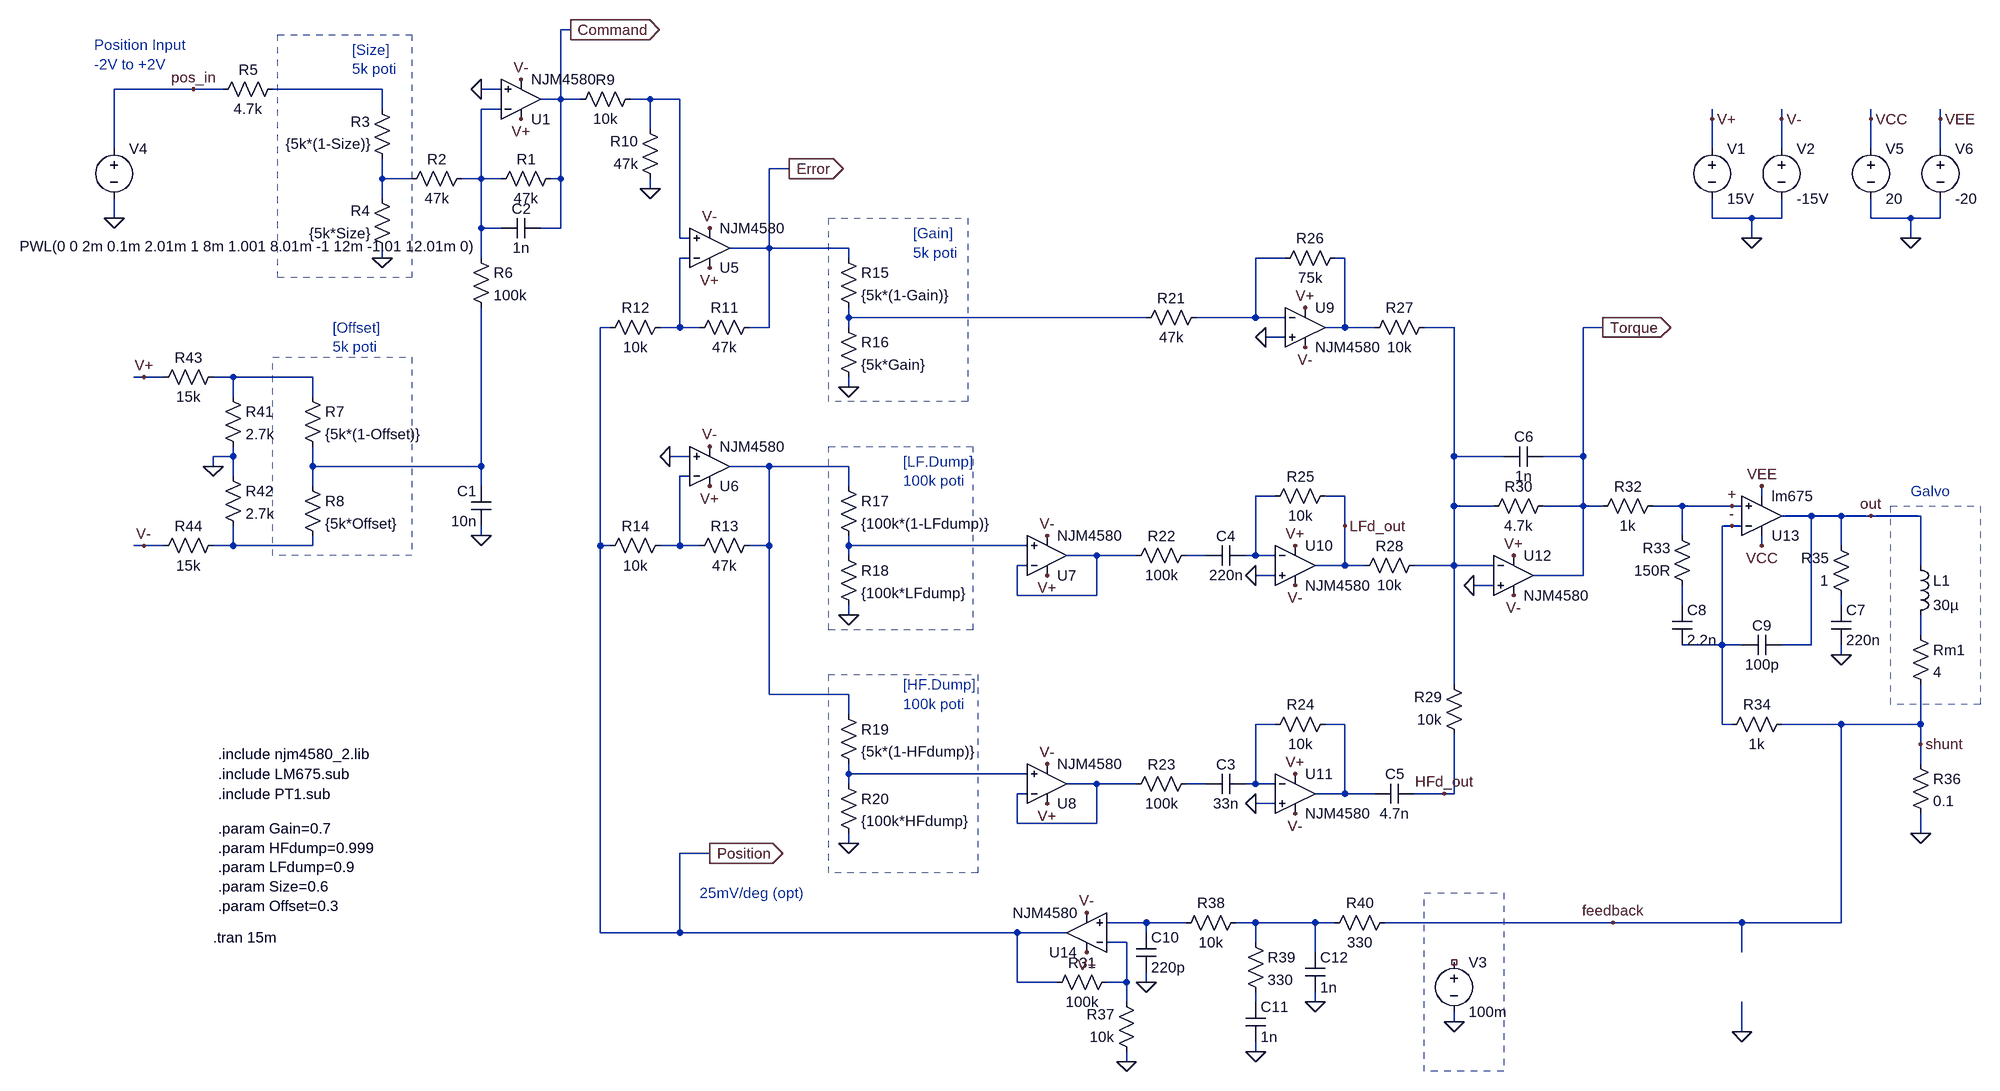
[diagram p0: schematic ctrlcircuit_v2.asc]
ctrlcircuit_v2.asc, the LTspice schematic file:
Version 4
SHEET 1 2372 1848
WIRE -208 144 -224 144
WIRE -816 240 -944 240
WIRE -768 240 -816 240
WIRE -512 240 -688 240
WIRE -320 240 -352 240
WIRE -224 256 -224 144
WIRE -224 256 -256 256
WIRE -192 256 -224 256
WIRE -80 256 -112 256
WIRE -32 256 -80 256
WIRE -512 272 -512 240
WIRE -320 272 -352 272
WIRE 1632 288 1632 272
WIRE 1744 288 1744 272
WIRE 1888 288 1888 272
WIRE 2000 288 2000 272
WIRE -80 304 -80 256
WIRE -944 336 -944 240
WIRE 1632 336 1632 288
WIRE 1744 336 1744 288
WIRE 1888 336 1888 288
WIRE 2000 336 2000 288
WIRE 144 368 112 368
WIRE -512 384 -512 352
WIRE -464 384 -512 384
WIRE -352 384 -352 272
WIRE -352 384 -384 384
WIRE -320 384 -352 384
WIRE -224 384 -224 256
WIRE -224 384 -240 384
WIRE -80 400 -80 384
WIRE -512 416 -512 384
WIRE -944 448 -944 416
WIRE 1632 448 1632 416
WIRE 1696 448 1632 448
WIRE 1744 448 1744 416
WIRE 1744 448 1696 448
WIRE 1888 448 1888 416
WIRE 1952 448 1888 448
WIRE 2000 448 2000 416
WIRE 2000 448 1952 448
WIRE -352 464 -352 384
WIRE -320 464 -352 464
WIRE -224 464 -224 384
WIRE -224 464 -256 464
WIRE -32 480 -32 256
WIRE -16 480 -32 480
WIRE 1696 480 1696 448
WIRE 1952 480 1952 448
WIRE 112 496 112 368
WIRE 112 496 48 496
WIRE 240 496 112 496
WIRE -512 512 -512 496
WIRE -352 512 -352 464
WIRE -16 512 -32 512
WIRE 240 512 240 496
WIRE 944 512 896 512
WIRE 1040 512 1024 512
WIRE 240 608 240 592
WIRE 720 608 240 608
WIRE 896 608 896 512
WIRE 896 608 800 608
WIRE 944 608 896 608
WIRE -144 624 -160 624
WIRE -32 624 -32 512
WIRE -32 624 -64 624
WIRE 0 624 -32 624
WIRE 112 624 112 496
WIRE 112 624 80 624
WIRE 240 624 240 608
WIRE 1040 624 1040 512
WIRE 1040 624 1008 624
WIRE 1088 624 1040 624
WIRE 1216 624 1168 624
WIRE 1456 624 1424 624
WIRE 944 640 912 640
WIRE -896 704 -912 704
WIRE -864 704 -896 704
WIRE -752 704 -784 704
WIRE -624 704 -752 704
WIRE 240 720 240 704
WIRE -752 736 -752 704
WIRE -624 736 -624 704
WIRE -752 832 -752 816
WIRE -752 832 -784 832
WIRE -16 832 -48 832
WIRE 1216 832 1216 624
WIRE 1296 832 1216 832
WIRE 1424 832 1424 624
WIRE 1424 832 1360 832
WIRE -784 848 -784 832
WIRE -624 848 -624 816
WIRE -352 848 -352 592
WIRE -352 848 -624 848
WIRE 112 848 48 848
WIRE 240 848 112 848
WIRE -752 864 -752 832
WIRE -16 864 -32 864
WIRE -624 880 -624 848
WIRE -352 880 -352 848
WIRE 240 880 240 848
WIRE 928 896 896 896
WIRE 1040 896 1008 896
WIRE 1712 896 1712 880
WIRE 1216 912 1216 832
WIRE 1280 912 1216 912
WIRE 1424 912 1424 832
WIRE 1424 912 1360 912
WIRE 1456 912 1424 912
WIRE 1584 912 1536 912
WIRE 1664 912 1584 912
WIRE 1680 912 1664 912
WIRE 1792 928 1744 928
WIRE 1840 928 1792 928
WIRE 1888 928 1840 928
WIRE 1968 928 1888 928
WIRE 1040 944 1040 896
WIRE 1664 944 1648 944
WIRE 1680 944 1664 944
WIRE -352 960 -352 944
WIRE 1584 960 1584 912
WIRE -896 976 -912 976
WIRE -864 976 -896 976
WIRE -752 976 -752 944
WIRE -752 976 -784 976
WIRE -624 976 -624 960
WIRE -624 976 -752 976
WIRE -160 976 -160 624
WIRE -144 976 -160 976
WIRE -32 976 -32 864
WIRE -32 976 -64 976
WIRE 0 976 -32 976
WIRE 112 976 112 848
WIRE 112 976 80 976
WIRE 240 976 240 960
WIRE 528 976 240 976
WIRE 1712 976 1712 960
WIRE 1840 976 1840 928
WIRE 240 992 240 976
WIRE 640 992 592 992
WIRE 704 992 640 992
WIRE 816 992 784 992
WIRE 896 992 896 896
WIRE 896 992 880 992
WIRE 928 992 896 992
WIRE 528 1008 512 1008
WIRE 1040 1008 1040 944
WIRE 1040 1008 992 1008
WIRE 1072 1008 1040 1008
WIRE 1216 1008 1216 912
WIRE 1216 1008 1152 1008
WIRE 1280 1008 1216 1008
WIRE 1968 1008 1968 928
WIRE 928 1024 896 1024
WIRE 1424 1024 1424 912
WIRE 1424 1024 1344 1024
WIRE 1280 1040 1248 1040
WIRE 512 1056 512 1008
WIRE 640 1056 640 992
WIRE 640 1056 512 1056
WIRE 1584 1072 1584 1040
WIRE 1840 1072 1840 1056
WIRE 240 1088 240 1072
WIRE 1968 1120 1968 1088
WIRE 1648 1136 1648 944
WIRE 1648 1136 1584 1136
WIRE 1680 1136 1648 1136
WIRE 1792 1136 1792 928
WIRE 1792 1136 1744 1136
WIRE 1840 1152 1840 1136
WIRE 1216 1200 1216 1008
WIRE 112 1216 112 976
WIRE 240 1216 112 1216
WIRE 240 1248 240 1216
WIRE 928 1264 896 1264
WIRE 1040 1264 1008 1264
WIRE 1648 1264 1648 1136
WIRE 1664 1264 1648 1264
WIRE 1840 1264 1744 1264
WIRE 1968 1264 1968 1200
WIRE 1968 1264 1840 1264
WIRE 1968 1296 1968 1264
WIRE 1968 1328 1968 1296
WIRE 240 1344 240 1328
WIRE 528 1344 240 1344
WIRE 240 1360 240 1344
WIRE 640 1360 592 1360
WIRE 704 1360 640 1360
WIRE 816 1360 784 1360
WIRE 896 1360 896 1264
WIRE 896 1360 880 1360
WIRE 928 1360 896 1360
WIRE 528 1376 512 1376
WIRE 1040 1376 1040 1264
WIRE 1040 1376 992 1376
WIRE 1088 1376 1040 1376
WIRE 1200 1376 1152 1376
WIRE 1216 1376 1216 1280
WIRE 1216 1376 1200 1376
WIRE 928 1392 896 1392
WIRE 512 1424 512 1376
WIRE 640 1424 640 1360
WIRE 640 1424 512 1424
WIRE 1968 1440 1968 1408
WIRE 240 1456 240 1440
WIRE 16 1472 -32 1472
WIRE 720 1584 656 1584
WIRE 784 1584 720 1584
WIRE 896 1584 864 1584
WIRE 992 1584 896 1584
WIRE 1024 1584 992 1584
WIRE 1472 1584 1104 1584
WIRE 1680 1584 1472 1584
WIRE 1840 1584 1840 1264
WIRE 1840 1584 1680 1584
WIRE -160 1600 -160 976
WIRE -32 1600 -32 1472
WIRE -32 1600 -160 1600
WIRE 512 1600 -32 1600
WIRE 592 1600 512 1600
WIRE 720 1600 720 1584
WIRE 688 1616 656 1616
WIRE 896 1616 896 1584
WIRE 992 1632 992 1584
WIRE 1680 1632 1680 1584
WIRE 512 1680 512 1600
WIRE 576 1680 512 1680
WIRE 688 1680 688 1616
WIRE 688 1680 656 1680
WIRE 720 1680 720 1664
WIRE 688 1712 688 1680
WIRE 896 1712 896 1696
WIRE 992 1712 992 1696
WIRE 1216 1744 1216 1728
WIRE 1680 1760 1680 1712
WIRE 896 1792 896 1776
WIRE 688 1808 688 1792
FLAG 1216 1744 0
FLAG 1696 480 0
FLAG 1632 288 V+
FLAG 1744 288 V-
FLAG -288 288 V+
FLAG -288 224 V-
FLAG 16 528 V+
FLAG 16 464 V-
FLAG 16 880 V+
FLAG 16 816 V-
FLAG 560 1024 V+
FLAG 560 960 V-
FLAG 560 1392 V+
FLAG 560 1328 V-
FLAG 976 592 V+
FLAG 976 656 V-
FLAG 960 976 V+
FLAG 960 1040 V-
FLAG 960 1344 V+
FLAG 960 1408 V-
FLAG 1312 992 V+
FLAG 1312 1056 V-
FLAG 1968 1440 0
FLAG 1712 880 VEE
FLAG 1712 976 VCC
FLAG 1888 928 out
FLAG 1968 1296 shunt
FLAG 1664 912 +
FLAG 1664 944 -
FLAG 624 1632 V+
FLAG 624 1568 V-
FLAG -512 512 0
FLAG -352 960 0
FLAG -352 240 0
FLAG -80 400 0
FLAG 240 720 0
FLAG 240 1088 0
FLAG 240 1456 0
FLAG -48 832 0
FLAG 896 1392 0
FLAG 896 1024 0
FLAG 912 640 0
FLAG 1248 1040 0
FLAG 1840 1152 0
FLAG 688 1808 0
FLAG 720 1680 0
FLAG 896 1792 0
FLAG 992 1712 0
FLAG -816 240 pos_in
FLAG -784 848 0
FLAG -896 704 V+
FLAG -896 976 V-
FLAG -944 448 0
FLAG -208 144 Command
IOPIN -208 144 Out
FLAG 144 368 Error
IOPIN 144 368 Out
FLAG 16 1472 Position
IOPIN 16 1472 Out
FLAG 1456 624 Torque
IOPIN 1456 624 Out
FLAG 1952 480 0
FLAG 1888 288 VCC
FLAG 2000 288 VEE
FLAG 1472 1584 feedback
FLAG 1680 1760 0
FLAG 1200 1376 HFd_out
FLAG 1040 944 LFd_out
SYMBOL voltage 1632 320 R0
WINDOW 123 0 0 Left 0
WINDOW 39 0 0 Left 0
SYMATTR InstName V1
SYMATTR Value 15V
SYMBOL voltage 1744 320 R0
WINDOW 123 0 0 Left 0
WINDOW 39 0 0 Left 0
SYMATTR InstName V2
SYMATTR Value -15V
SYMBOL voltage 1216 1632 R0
WINDOW 123 0 0 Left 0
WINDOW 39 0 0 Left 0
SYMATTR InstName V3
SYMATTR Value 100m
SYMBOL Opamps\\opamp2 -288 320 M180
SYMATTR InstName U1
SYMATTR Value NJM4580
SYMBOL res -224 368 R90
WINDOW 0 0 56 VBottom 0
WINDOW 3 32 56 VTop 0
SYMATTR InstName R1
SYMATTR Value 47k
SYMBOL res -368 368 R90
WINDOW 0 0 56 VBottom 0
WINDOW 3 32 56 VTop 0
SYMATTR InstName R2
SYMATTR Value 47k
SYMBOL res -496 368 R180
WINDOW 0 36 76 Left 0
WINDOW 3 36 40 Left 0
SYMATTR InstName R3
SYMATTR Value {5k*(1-Size)}
SYMBOL res -496 512 R180
WINDOW 0 36 76 Left 0
WINDOW 3 36 40 Left 0
SYMATTR InstName R4
SYMATTR Value {5k*Size}
SYMBOL res -784 256 R270
WINDOW 0 32 56 VTop 0
WINDOW 3 0 56 VBottom 0
SYMATTR InstName R5
SYMATTR Value 4.7k
SYMBOL res -368 496 R0
SYMATTR InstName R6
SYMATTR Value 100k
SYMBOL res -640 720 R0
SYMATTR InstName R7
SYMATTR Value {5k*(1-Offset)}
SYMBOL res -640 864 R0
SYMATTR InstName R8
SYMATTR Value {5k*Offset}
SYMBOL cap -336 944 R180
WINDOW 0 24 56 Left 0
WINDOW 3 24 8 Left 0
SYMATTR InstName C1
SYMATTR Value 10n
SYMBOL cap -320 480 R270
WINDOW 0 32 32 VTop 0
WINDOW 3 0 32 VBottom 0
SYMATTR InstName C2
SYMATTR Value 1n
SYMBOL res -96 240 R90
WINDOW 0 0 56 VBottom 0
WINDOW 3 32 56 VTop 0
SYMATTR InstName R9
SYMATTR Value 10k
SYMBOL res -64 400 R180
WINDOW 0 36 76 Left 0
WINDOW 3 36 40 Left 0
SYMATTR InstName R10
SYMATTR Value 47k
SYMBOL Opamps\\opamp2 16 560 M180
SYMATTR InstName U5
SYMATTR Value NJM4580
SYMBOL res 96 608 R90
WINDOW 0 0 56 VBottom 0
WINDOW 3 32 56 VTop 0
SYMATTR InstName R11
SYMATTR Value 47k
SYMBOL res -48 608 R90
WINDOW 0 0 56 VBottom 0
WINDOW 3 32 56 VTop 0
SYMATTR InstName R12
SYMATTR Value 10k
SYMBOL Opamps\\opamp2 16 912 M180
SYMATTR InstName U6
SYMATTR Value NJM4580
SYMBOL res 96 960 R90
WINDOW 0 0 56 VBottom 0
WINDOW 3 32 56 VTop 0
SYMATTR InstName R13
SYMATTR Value 47k
SYMBOL res -48 960 R90
WINDOW 0 0 56 VBottom 0
WINDOW 3 32 56 VTop 0
SYMATTR InstName R14
SYMATTR Value 10k
SYMBOL res 224 496 R0
SYMATTR InstName R15
SYMATTR Value {5k*(1-Gain)}
SYMBOL res 224 608 R0
SYMATTR InstName R16
SYMATTR Value {5k*Gain}
SYMBOL res 224 864 R0
SYMATTR InstName R17
SYMATTR Value {100k*(1-LFdump)}
SYMBOL res 224 976 R0
SYMATTR InstName R18
SYMATTR Value {100k*LFdump}
SYMBOL res 224 1232 R0
SYMATTR InstName R19
SYMATTR Value {5k*(1-HFdump)}
SYMBOL res 224 1344 R0
SYMATTR InstName R20
SYMATTR Value {100k*HFdump}
SYMBOL Opamps\\opamp2 560 1056 M180
SYMATTR InstName U7
SYMATTR Value NJM4580
SYMBOL Opamps\\opamp2 560 1424 M180
SYMATTR InstName U8
SYMATTR Value NJM4580
SYMBOL res 816 592 R90
WINDOW 0 0 56 VBottom 0
WINDOW 3 32 56 VTop 0
SYMATTR InstName R21
SYMATTR Value 47k
SYMBOL res 800 976 R90
WINDOW 0 0 56 VBottom 0
WINDOW 3 32 56 VTop 0
SYMATTR InstName R22
SYMATTR Value 100k
SYMBOL res 800 1344 R90
WINDOW 0 0 56 VBottom 0
WINDOW 3 32 56 VTop 0
SYMATTR InstName R23
SYMATTR Value 100k
SYMBOL cap 880 1344 R90
WINDOW 0 0 32 VBottom 0
WINDOW 3 32 32 VTop 0
SYMATTR InstName C3
SYMATTR Value 33n
SYMBOL cap 880 976 R90
WINDOW 0 0 32 VBottom 0
WINDOW 3 32 32 VTop 0
SYMATTR InstName C4
SYMATTR Value 220n
SYMBOL Opamps\\opamp2 976 560 R0
SYMATTR InstName U9
SYMATTR Value NJM4580
SYMBOL Opamps\\opamp2 960 944 R0
SYMATTR InstName U10
SYMATTR Value NJM4580
SYMBOL Opamps\\opamp2 960 1312 R0
SYMATTR InstName U11
SYMATTR Value NJM4580
SYMBOL res 1024 1248 R90
WINDOW 0 0 56 VBottom 0
WINDOW 3 32 56 VTop 0
SYMATTR InstName R24
SYMATTR Value 10k
SYMBOL res 1024 880 R90
WINDOW 0 0 56 VBottom 0
WINDOW 3 32 56 VTop 0
SYMATTR InstName R25
SYMATTR Value 10k
SYMBOL res 1040 496 R90
WINDOW 0 0 56 VBottom 0
WINDOW 3 32 56 VTop 0
SYMATTR InstName R26
SYMATTR Value 75k
SYMBOL res 1184 608 R90
WINDOW 0 0 56 VBottom 0
WINDOW 3 32 56 VTop 0
SYMATTR InstName R27
SYMATTR Value 10k
SYMBOL res 1168 992 R90
WINDOW 0 0 56 VBottom 0
WINDOW 3 32 56 VTop 0
SYMATTR InstName R28
SYMATTR Value 10k
SYMBOL res 1232 1296 R180
WINDOW 0 36 76 Left 0
WINDOW 3 36 40 Left 0
SYMATTR InstName R29
SYMATTR Value 10k
SYMBOL cap 1152 1360 R90
WINDOW 0 0 32 VBottom 0
WINDOW 3 32 32 VTop 0
SYMATTR InstName C5
SYMATTR Value 4.7n
SYMBOL Opamps\\opamp2 1312 960 R0
SYMATTR InstName U12
SYMATTR Value NJM4580
SYMBOL res 1376 896 R90
WINDOW 0 0 56 VBottom 0
WINDOW 3 32 56 VTop 0
SYMATTR InstName R30
SYMATTR Value 4.7k
SYMBOL cap 1360 816 R90
WINDOW 0 0 32 VBottom 0
WINDOW 3 32 32 VTop 0
SYMATTR InstName C6
SYMATTR Value 1n
SYMBOL res 1552 896 R90
WINDOW 0 0 56 VBottom 0
WINDOW 3 32 56 VTop 0
SYMATTR InstName R32
SYMATTR Value 1k
SYMBOL res 1600 1056 R180
WINDOW 0 36 76 Left 0
WINDOW 3 36 40 Left 0
SYMATTR InstName R33
SYMATTR Value 150R
SYMBOL res 1760 1248 R90
WINDOW 0 0 56 VBottom 0
WINDOW 3 32 56 VTop 0
SYMATTR InstName R34
SYMATTR Value 1k
SYMBOL res 1856 1072 R180
WINDOW 0 36 76 Left 0
WINDOW 3 36 40 Left 0
SYMATTR InstName R35
SYMATTR Value 1
SYMBOL cap 1568 1072 R0
SYMATTR InstName C8
SYMATTR Value 2.2n
SYMBOL ind 1952 992 R0
SYMATTR InstName L1
SYMATTR Value 30µ
SYMBOL res 1952 1312 R0
SYMATTR InstName R36
SYMATTR Value 0.1
SYMBOL res 1952 1104 R0
SYMATTR InstName Rm1
SYMATTR Value 4
SYMBOL Opamps\\opamp2 1712 992 M180
SYMATTR InstName U13
SYMATTR Value lm675
SYMBOL cap 1824 1072 R0
SYMATTR InstName C7
SYMATTR Value 220n
SYMBOL cap 1744 1120 R90
WINDOW 0 0 32 VBottom 0
WINDOW 3 32 32 VTop 0
SYMATTR InstName C9
SYMATTR Value 100p
SYMBOL Opamps\\opamp2 624 1664 R180
SYMATTR InstName U14
SYMATTR Value NJM4580
SYMBOL res 672 1664 R90
WINDOW 0 0 56 VBottom 0
WINDOW 3 32 56 VTop 0
SYMATTR InstName R31
SYMATTR Value 100k
SYMBOL res 704 1808 R180
WINDOW 0 36 76 Left 0
WINDOW 3 36 40 Left 0
SYMATTR InstName R37
SYMATTR Value 10k
SYMBOL res 768 1600 R270
WINDOW 0 32 56 VTop 0
WINDOW 3 0 56 VBottom 0
SYMATTR InstName R38
SYMATTR Value 10k
SYMBOL res 880 1600 R0
SYMATTR InstName R39
SYMATTR Value 330
SYMBOL res 1120 1568 R90
WINDOW 0 0 56 VBottom 0
WINDOW 3 32 56 VTop 0
SYMATTR InstName R40
SYMATTR Value 330
SYMBOL cap 704 1600 R0
SYMATTR InstName C10
SYMATTR Value 220p
SYMBOL cap 880 1712 R0
SYMATTR InstName C11
SYMATTR Value 1n
SYMBOL cap 976 1632 R0
SYMATTR InstName C12
SYMATTR Value 1n
SYMBOL res -768 720 R0
SYMATTR InstName R41
SYMATTR Value 2.7k
SYMBOL res -768 848 R0
SYMATTR InstName R42
SYMATTR Value 2.7k
SYMBOL res -768 688 R90
WINDOW 0 0 56 VBottom 0
WINDOW 3 32 56 VTop 0
SYMATTR InstName R43
SYMATTR Value 15k
SYMBOL res -768 960 R90
WINDOW 0 0 56 VBottom 0
WINDOW 3 32 56 VTop 0
SYMATTR InstName R44
SYMATTR Value 15k
SYMBOL voltage -944 320 R0
WINDOW 3 -152 173 Left 0
WINDOW 123 0 0 Left 0
WINDOW 39 0 0 Left 0
SYMATTR Value PWL(0 0 2m 0.1m 2.01m 1 8m 1.001 8.01m -1 12m -1.01 12.01m 0)
SYMATTR InstName V4
SYMBOL voltage 1888 320 R0
WINDOW 123 0 0 Left 0
WINDOW 39 0 0 Left 0
SYMATTR InstName V5
SYMATTR Value 20
SYMBOL voltage 2000 320 R0
WINDOW 123 0 0 Left 0
WINDOW 39 0 0 Left 0
SYMATTR InstName V6
SYMATTR Value -20
TEXT -776 1312 Left 0 !.include njm4580_2.lib
TEXT -776 1344 Left 0 !.include LM675.sub
TEXT -976 168 Left 0 ;Position Input\n-2V to +2V
TEXT -560 176 Left 0 ;[Size]\n5k poti
TEXT -592 624 Left 0 ;[Offset]\n5k poti
TEXT 344 472 Left 0 ;[Gain]\n5k poti
TEXT 328 840 Left 0 ;[LF.Dump]\n100k poti
TEXT 328 1200 Left 0 ;[HF.Dump]\n100k poti
TEXT 1952 888 Left 0 ;Galvo
TEXT 0 1536 Left 0 ;25mV/deg (opt)
TEXT -776 1432 Left 0 !.param Gain=0.7\n.param HFdump=0.999\n.param LFdump=0.9\n.param Size=0.6\n.param Offset=0.3
TEXT -784 1608 Left 0 !.tran 15m
TEXT -776 1376 Left 0 !.include PT1.sub
RECTANGLE Normal -464 544 -680 152 2
RECTANGLE Normal -464 992 -688 672 2
RECTANGLE Normal 432 744 208 448 2
RECTANGLE Normal 440 1112 208 816 2
RECTANGLE Normal 448 1504 208 1184 2
RECTANGLE Normal 2064 1232 1920 912 2
RECTANGLE Normal 1296 1824 1168 1536 2

The netlist it stands for:
* ctrlcircuit_v2.asc
V1 V+ 0 15V
V2 V- 0 -15V
V3 NC_01 0 100m
XU1 0 N003 V+ V- Command NJM4580  ; pins In+ In- V+ V- OUT
R1 Command N003 47k
R2 N003 N004 47k
R3 N004 N001 {5k*(1-Size)}
R4 0 N004 {5k*Size}
R5 pos_in N001 4.7k
R6 N003 N011 100k
R7 N010 N011 {5k*(1-Offset)}
R8 N011 N015 {5k*Offset}
C1 0 N011 10n
C2 N003 Command 1n
R9 N002 Command 10k
R10 0 N002 47k
XU5 N002 N005 V+ V- Error NJM4580  ; pins In+ In- V+ V- OUT
R11 Error N005 47k
R12 N005 Position 10k
XU6 0 N013 V+ V- N012 NJM4580  ; pins In+ In- V+ V- OUT
R13 N012 N013 47k
R14 N013 Position 10k
R15 Error N008 {5k*(1-Gain)}
R16 N008 0 {5k*Gain}
R17 N012 N016 {100k*(1-LFdump)}
R18 N016 0 {100k*LFdump}
R19 N012 N024 {5k*(1-HFdump)}
R20 N024 0 {100k*HFdump}
XU7 N016 N017 V+ V- N017 NJM4580  ; pins In+ In- V+ V- OUT
XU8 N024 N025 V+ V- N025 NJM4580  ; pins In+ In- V+ V- OUT
R21 N006 N008 47k
R22 N018 N017 100k
R23 N026 N025 100k
C3 N022 N026 33n
C4 N014 N018 220n
XU9 0 N006 V+ V- N007 NJM4580  ; pins In+ In- V+ V- OUT
XU10 0 N014 V+ V- LFd_out NJM4580  ; pins In+ In- V+ V- OUT
XU11 0 N022 V+ V- N023 NJM4580  ; pins In+ In- V+ V- OUT
R24 N023 N022 10k
R25 LFd_out N014 10k
R26 N007 N006 75k
R27 N009 N007 10k
R28 N009 LFd_out 10k
R29 HFd_out N009 10k
C5 HFd_out N023 4.7n
XU12 0 N009 V+ V- Torque NJM4580  ; pins In+ In- V+ V- OUT
R30 Torque N009 4.7k
C6 Torque N009 1n
R32 + Torque 1k
R33 N019 + 150R
R34 feedback - 1k
R35 N020 out 1
C8 N019 - 2.2n
L1 out N021 30µ
R36 feedback 0 0.1
Rm1 N021 feedback 4
XU13 + - VCC VEE out lm675  ; pins In+ In- V+ V- OUT
C7 N020 0 220n
C9 out - 100p
XU14 N027 N029 V+ V- Position NJM4580  ; pins In+ In- V+ V- OUT
R31 N029 Position 100k
R37 0 N029 10k
R38 N027 N028 10k
R39 N028 N030 330
R40 feedback N028 330
C10 N027 0 220p
C11 N030 0 1n
C12 N028 0 1n
R41 N010 0 2.7k
R42 0 N015 2.7k
R43 N010 V+ 15k
R44 N015 V- 15k
V4 pos_in 0 PWL(0 0 2m 0.1m 2.01m 1 8m 1.001 8.01m -1 12m -1.01 12.01m 0)
V5 VCC 0 20
V6 VEE 0 -20
.include njm4580_2.lib
.include LM675.sub
* Position Input
* -2V to +2V
* [Size]
* 5k poti
* [Offset]
* 5k poti
* [Gain]
* 5k poti
* [LF.Dump]
* 100k poti
* [HF.Dump]
* 100k poti
* Galvo
* 25mV/deg (opt)
.param Gain=0.7
.param HFdump=0.999
.param LFdump=0.9
.param Size=0.6
.param Offset=0.3
.tran 15m
.include PT1.sub
.backanno
.end